# EAGLE design alarma-ESP32-30 (EAGLE 7.2.0)
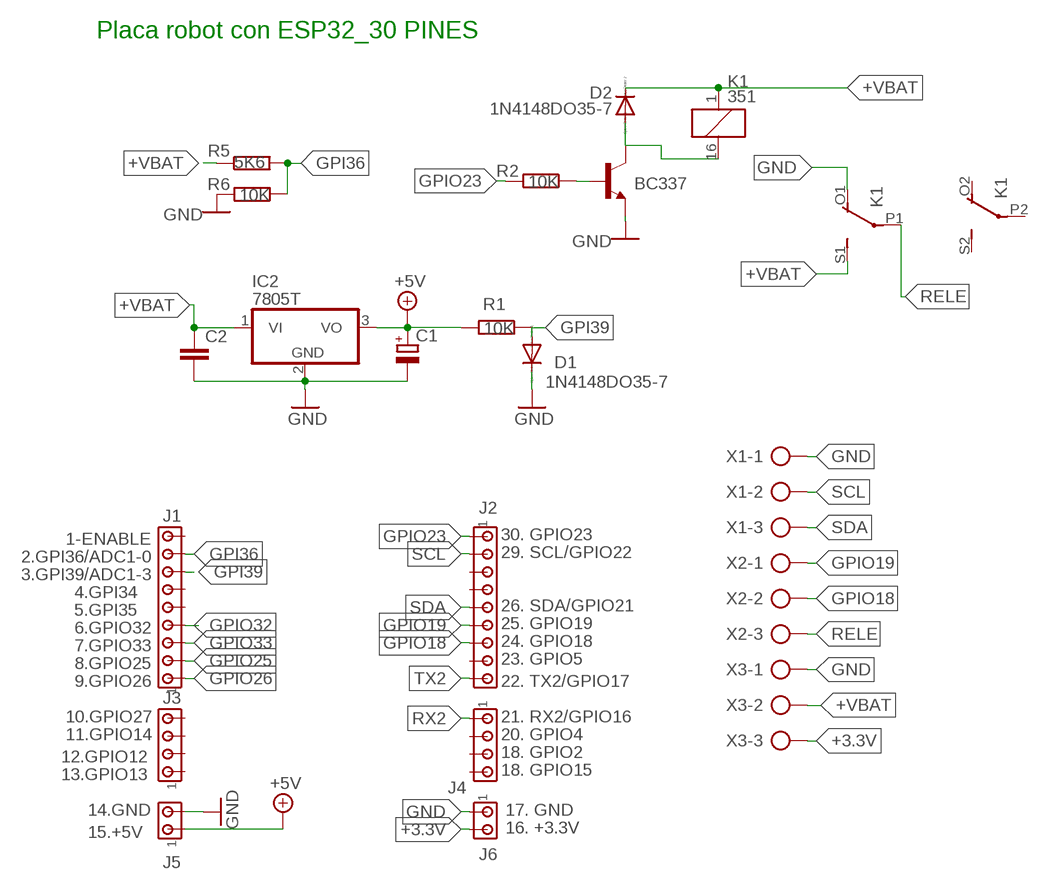
[diagram p0: schematic, sheet 1]

## Parts
BC337  BC337-16-NPN-TO92-CBE  [TO92-CBE]
C1  CPOL-EUE2.5-6  [E2,5-6]
C2  C-EU025-025X050  [C025-025X050]
D1  1N4148DO35-7  [DO35-7]
D2  1N4148DO35-7  [DO35-7]
IC2  7805T  [TO220H]
J1  MTA09-100  [10X09MTA]
J2  MTA09-100  [10X09MTA]
J3  MTA04-100  [10X04MTA]
J4  MTA04-100  [10X04MTA]
J5  MTA02-100  [10X02MTA]
J6  MTA02-100  [10X02MTA]
K1  351  [351]
R1  10K  R-EU_0207/7  [0207/7]
R2  10K  R-EU_0207/15  [0207/15]
R5  5K6  R-EU_0207/7  [0207/7]
R6  10K  R-EU_0207/7  [0207/7]
X1  AK500/3  [AK500/3]
X2  AK500/3  [AK500/3]
X3  AK500/3  [AK500/3]

## Nets
+3.3V: J6.2 X3.3
+5V: C1.+ IC2.3(VO) J5.1 R1.2
+VBAT: C2.1 D2.C IC2.1(VI) K1.1 K1.S1(2:S) R5.1 X3.2
GND: BC337.E C1.- C2.2 D1.C IC2.2(GND) J5.2 J6.1 K1.O1(2:O) R6.2 X1.1 X3.1
GPI36: J1.8 R5.2 R6.1
GPI39: D1.A J1.7 R1.1
GPIO18: J2.7 X2.2
GPIO19: J2.6 X2.1
GPIO23: J2.1 R2.2
GPIO25: J1.2
GPIO26: J1.1
GPIO32: J1.4
GPIO33: J1.3
N$1: BC337.C D2.A K1.16
N$3: BC337.B R2.1
RELE: K1.P1(2:P) X2.3
RX2: J4.1
SCL: J2.2 X1.2
SDA: J2.5 X1.3
TX2: J2.9
Unconnected: J1.5 J1.6 J1.9 J2.3 J2.4 J2.8 J3.1 J3.2 J3.3 J3.4 J4.2 J4.3 J4.4 K1.O2(3:O) K1.P2(3:P) K1.S2(3:S)

## Notes on the sheet
- Placa robot con ESP32_30 PINES
- 1-ENABLE | 30. GPIO23
- 2.GPI36/ADC1-0 | 29. SCL/GPIO22
- 3.GPI39/ADC1-3
- 4.GPI34
- 5.GPI35 | 26. SDA/GPIO21
- 6.GPIO32 | 25. GPIO19
- 7.GPIO33 | 24. GPIO18
- 8.GPIO25 | 23. GPIO5
- 9.GPIO26 | 22. TX2/GPIO17
- 10.GPIO27 | 21. RX2/GPIO16
- 11.GPIO14 | 20. GPIO4
- 12.GPIO12 | 18. GPIO2
- 13.GPIO13 | 18. GPIO15
- 14.GND | 17. GND
- 15.+5V | 16. +3.3V

## Library data of the parts
BC337 = transistor:*-NPN-: NPN Transistror BF959 corrected 2008.03.06
C1 = resistor:CPOL-EU: POLARIZED CAPACITOR, European symbol
C2 = rcl:C-EU: CAPACITOR, European symbol
D1 D2 = diode:1N4148: DIODE high speed (Philips)
IC2 = linear:78*: Positive VOLTAGE REGULATOR Source: http://cache.national.com/ds/LM/LM78L05.pdf http://www.fairchildsemi.com/ds/LM/LM7805.pdf
J1 J2 = con-amp:MTA09-100: AMP connector
J3 J4 = con-amp:MTA04-100: AMP connector
J5 J6 = con-amp:MTA02-100: AMP connector
K1 = relay:351: RELAY 2 x switch, Omron; OC_FARNELL: unknown; OC_NEWARK: unknown
R1 R2 R5 R6 = rcl:R-EU_: RESISTOR, European symbol
X1-X3 = con-ptr500:AK500/3: CONNECTOR; OC_FARNELL: unknown; OC_NEWARK: unknown

## Board
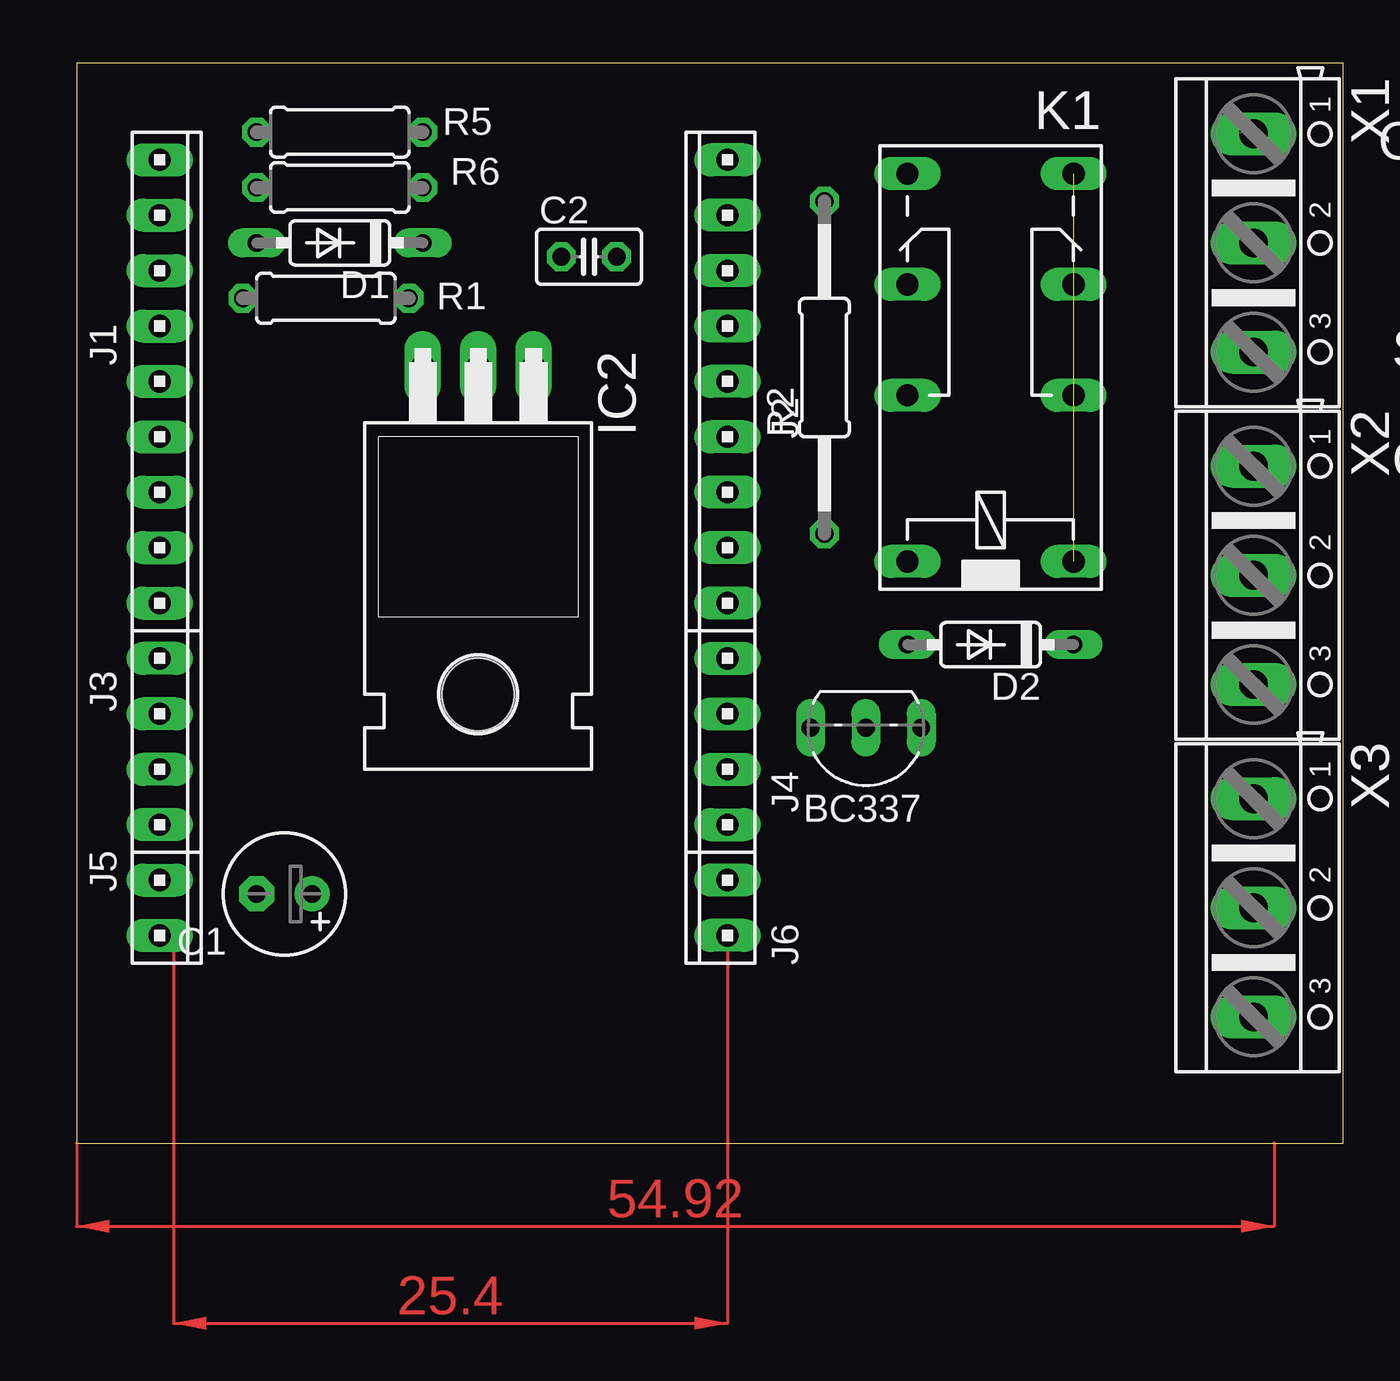
[diagram p1: board, top side]
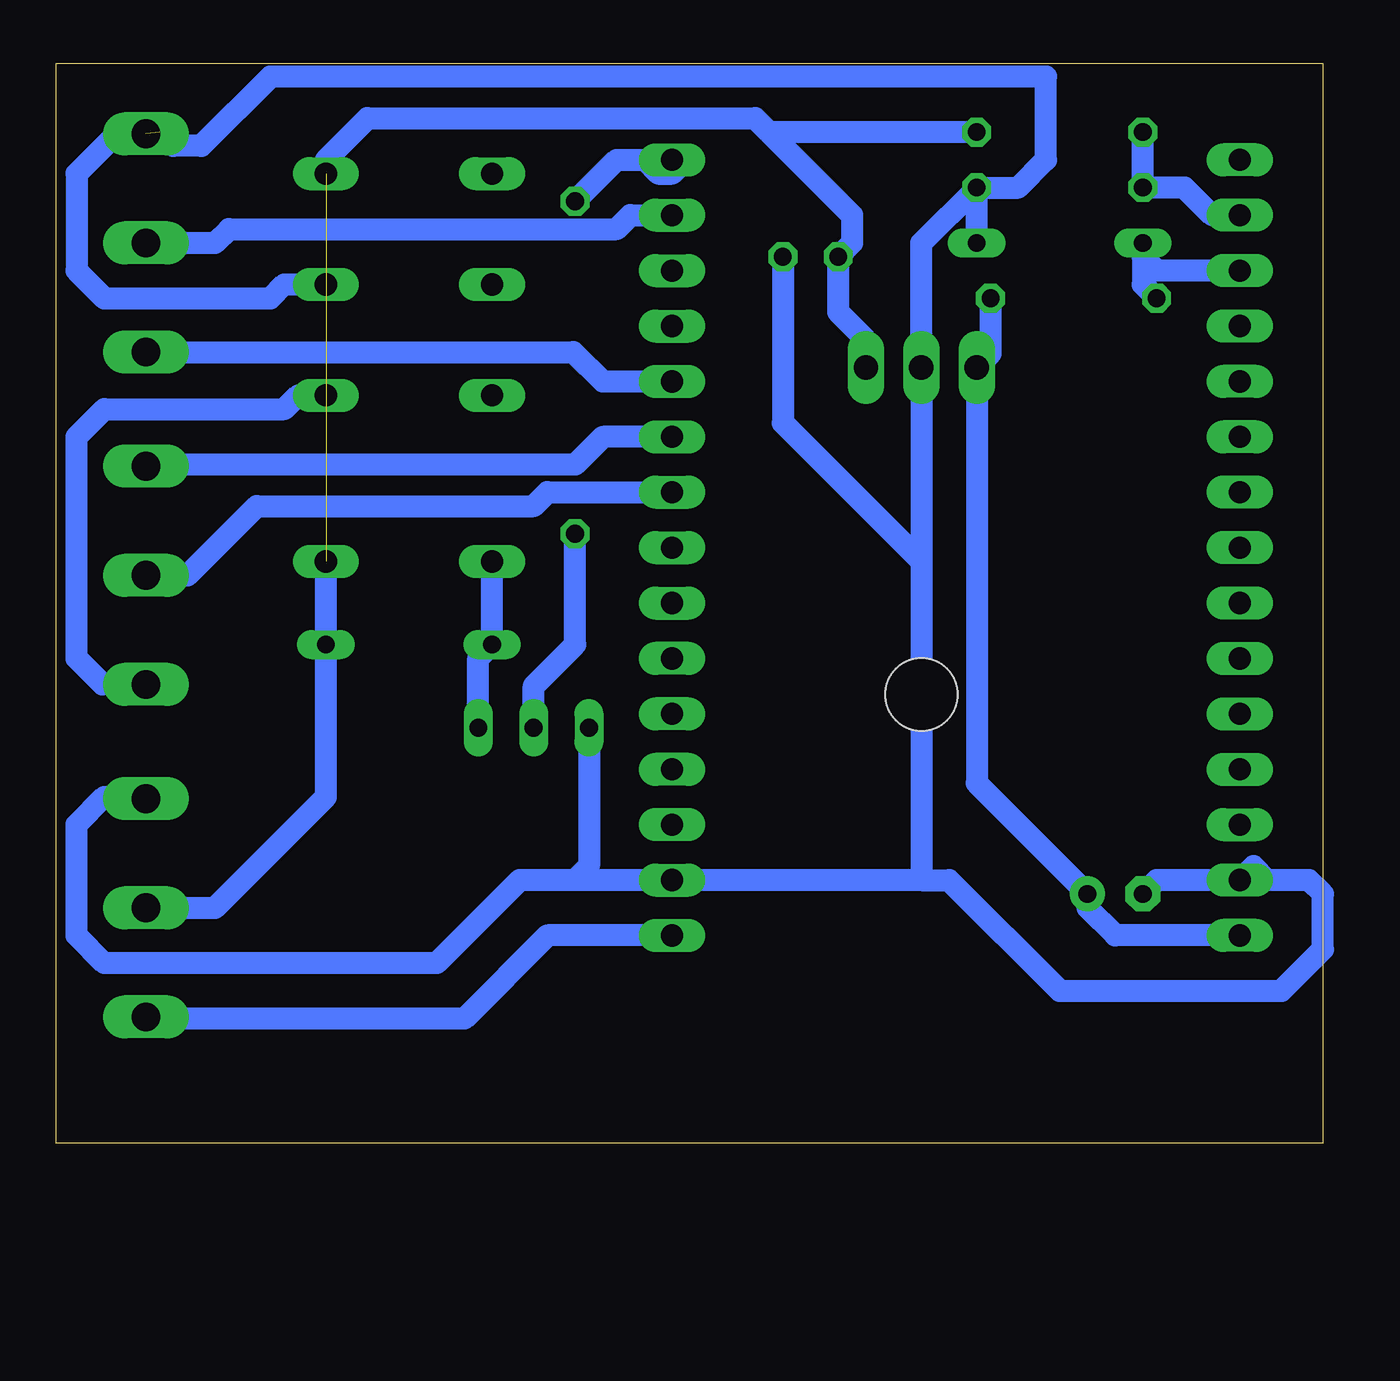
[diagram p2: board, bottom side, seen from below]

Size 58.09 x 49.52 mm. Coordinates in mm from the lower left corner, seen from the top.
Outline: 0,0 58.09,0 58.09,49.52 0,49.52 0,0
Copper layers (1*16): Top 0.035mm / dielectric 1.5mm / Bottom 0.035mm
Design rules "default": minimum track width 10mil, minimum drill 24mil, track to track 8mil, track to pad 8mil, pad to pad 8mil, via to via 8mil, smd to smd 8mil, copper to edge 40mil, drill to drill 8mil, minimum pad ring 10mil, minimum via ring 8mil, stop-mask expansion 4mil, vias tented up to drill 0mil, thermal gap 10mil

### Footprints (pad centres in the part's own frame; a part is rotated, then mirrored left to right if it is on the bottom)
TO92-CBE = drill 0.813 long: B 0,0; C -2.54,0; E 2.54,0
E2,5-6 = drill 0.813 pad 1.6: + -1.27,0 | drill 0.813 pad 1.6 octagon: - 1.27,0
C025-025X050 = drill 0.813 octagon: 1 -1.27,0; 2 1.27,0
DO35-7 = drill 0.813 long: A 3.81,0; C -3.81,0
TO220H = drill 1.118 long: 1 -2.54,-10.16; 2 0,-10.16; 3 2.54,-10.16 | hole 3.302: 0,4.826
10X09MTA = drill 1.016 long: 1 10.16,0; 2 7.62,0; 3 5.08,0; 4 2.54,0; 5 0,0; 6 -2.54,0; 7 -5.08,0; 8 -7.62,0; 9 -10.16,0
10X04MTA = drill 1.016 long: 1 3.81,0; 2 1.27,0; 3 -1.27,0; 4 -3.81,0
10X02MTA = drill 1.016 long: 1 1.27,0; 2 -1.27,0
351 = drill 1.016 long: 1 -3.81,-3.81; 16 -3.81,3.81; O1 8.89,-3.81; O2 8.89,3.81; P1 3.81,-3.81; P2 3.81,3.81; S1 13.97,-3.81; S2 13.97,3.81
0207/7 = drill 0.813 octagon: 1 -3.81,0; 2 3.81,0
0207/15 = drill 0.813 octagon: 1 -7.62,0; 2 7.62,0
AK500/3 = drill 1.321 long: 1 -5.004,0; 2 0,0; 3 5.004,0

### Placement (x,y rotation side)
BC337  36.19,19.05 180 top
C1  9.52,11.43 180 top
C2  23.5,40.64 0 top
D1  12.06,41.27 180 top
D2  41.91,22.86 180 top
IC2  18.42,25.4 180 top
J1  3.81,34.92 270 top
J2  29.85,34.92 90 top
J3  3.81,18.41 270 top
J4  29.85,18.41 90 top
J5  3.81,10.79 270 top
J6  29.85,10.79 90 top
K1  41.91,30.48 90 top
R1  11.43,38.73 0 top
R2  34.29,35.56 90 top
R5  12.06,46.35 180 top
R6  12.06,43.81 0 top
X1  53.98,41.27 270 top
X2  53.98,26.03 270 top
X3  53.98,10.79 270 top

### Tracks (layer width: path | path; a pad name or v marks a point on that pad's centre or on a via)
+3.3V
  Bottom 1.016: J6.2 35.56,9.52 39.37,5.71 53.9,5.71 X3.3
+5V
  Bottom 1.016: R1.2 15.24,36.2 IC2.3 15.87,16.51 C1.+ 10.79,10.79 9.52,9.52 J5.1
+VBAT  (1 unrouted)
  Bottom 1.016: K1.1 D2.C 45.72,15.88 50.8,10.79 X3.2 | K1.S1 45.72,45.09 43.81,46.99 26.04,46.99 25.4,46.35 | 25.4,46.35 21.59,42.55 21.59,41.27 C2.1 22.22,38.1 20.96,36.83 IC2.1 | R5.1 25.4,46.35
GND  (1 unrouted)
  Bottom 1.016: X1.1 55.32,46.28 57.15,44.45 57.15,40.01 55.88,38.73 48.26,38.73 47.62,39.37 K1.O1 | 34.29,12.06 J6.1 18.42,12.06 | 34.29,12.06 36.83,12.06 40.64,8.25 55.88,8.25 57.15,9.52 57.15,14.61 55.88,15.88 54.05,15.88 X3.1 | BC337.E 33.66,12.7 34.29,12.06 | 18.42,26.67 IC2.2 18.42,41.27 R6.2 | 18.42,26.67 18.42,12.06 | R6.2 13.97,43.81 12.7,45.09 12.7,48.89 48.26,48.89 51.44,45.72 52.7,45.72 53.34,46.35 | C2.2 24.76,33.02 18.42,26.67 | D1.C R6.2 | C1.- 7.62,12.06 J5.2 3.18,12.7 2.54,12.06 0.63,12.06 0,11.43 0,8.89 1.9,6.98 12.06,6.98 17.14,12.06 18.42,12.06
GPI36
  Bottom 1.016: J1.8 5.08,42.55 6.35,43.81 R6.1 R5.2
GPI39
  Bottom 1.016: D1.A 8.25,40.64 | 8.25,40.64 8.25,39.37 R1.1 | J1.7 7.62,40.01 8.25,40.64
GPIO18
  Bottom 1.016: X2.2 52.07,26.03 48.89,29.21 36.19,29.21 35.56,29.84 J2.7
GPIO19
  Bottom 1.016: J2.6 33.02,32.38 34.29,31.12 53.9,31.12 X2.1
GPIO23
  Bottom 1.016: R2.2 32.39,45.09 31.11,45.09 30.48,44.45 29.85,44.45 29.21,45.09 J2.1
N$1
  Bottom 1.016: BC337.C 38.73,22.22 D2.A K1.16
N$3
  Bottom 1.016: BC337.B 36.19,20.95 34.29,22.86 R2.1
RELE
  Bottom 1.016: X2.3 55.96,21.03 57.15,22.22 57.15,32.38 55.88,33.66 47.62,33.66 46.99,34.29 K1.P1
SCL
  Bottom 1.016: X1.2 50.8,41.27 50.17,41.91 32.39,41.91 31.75,42.55 J2.2
SDA
  Bottom 1.016: X1.3 34.37,36.27 33.02,34.92 J2.5
(copper drawn outside any net)
  shapes: Top area x3

### Text on the board
tNames: GND | SDA | SCL | GPIO19 | GPIO18 | RELE | GND | +VBAT | +3.3V